# EAGLE design 1541_Multi-ROM_Rev1.1 (EAGLE 9.7.0)
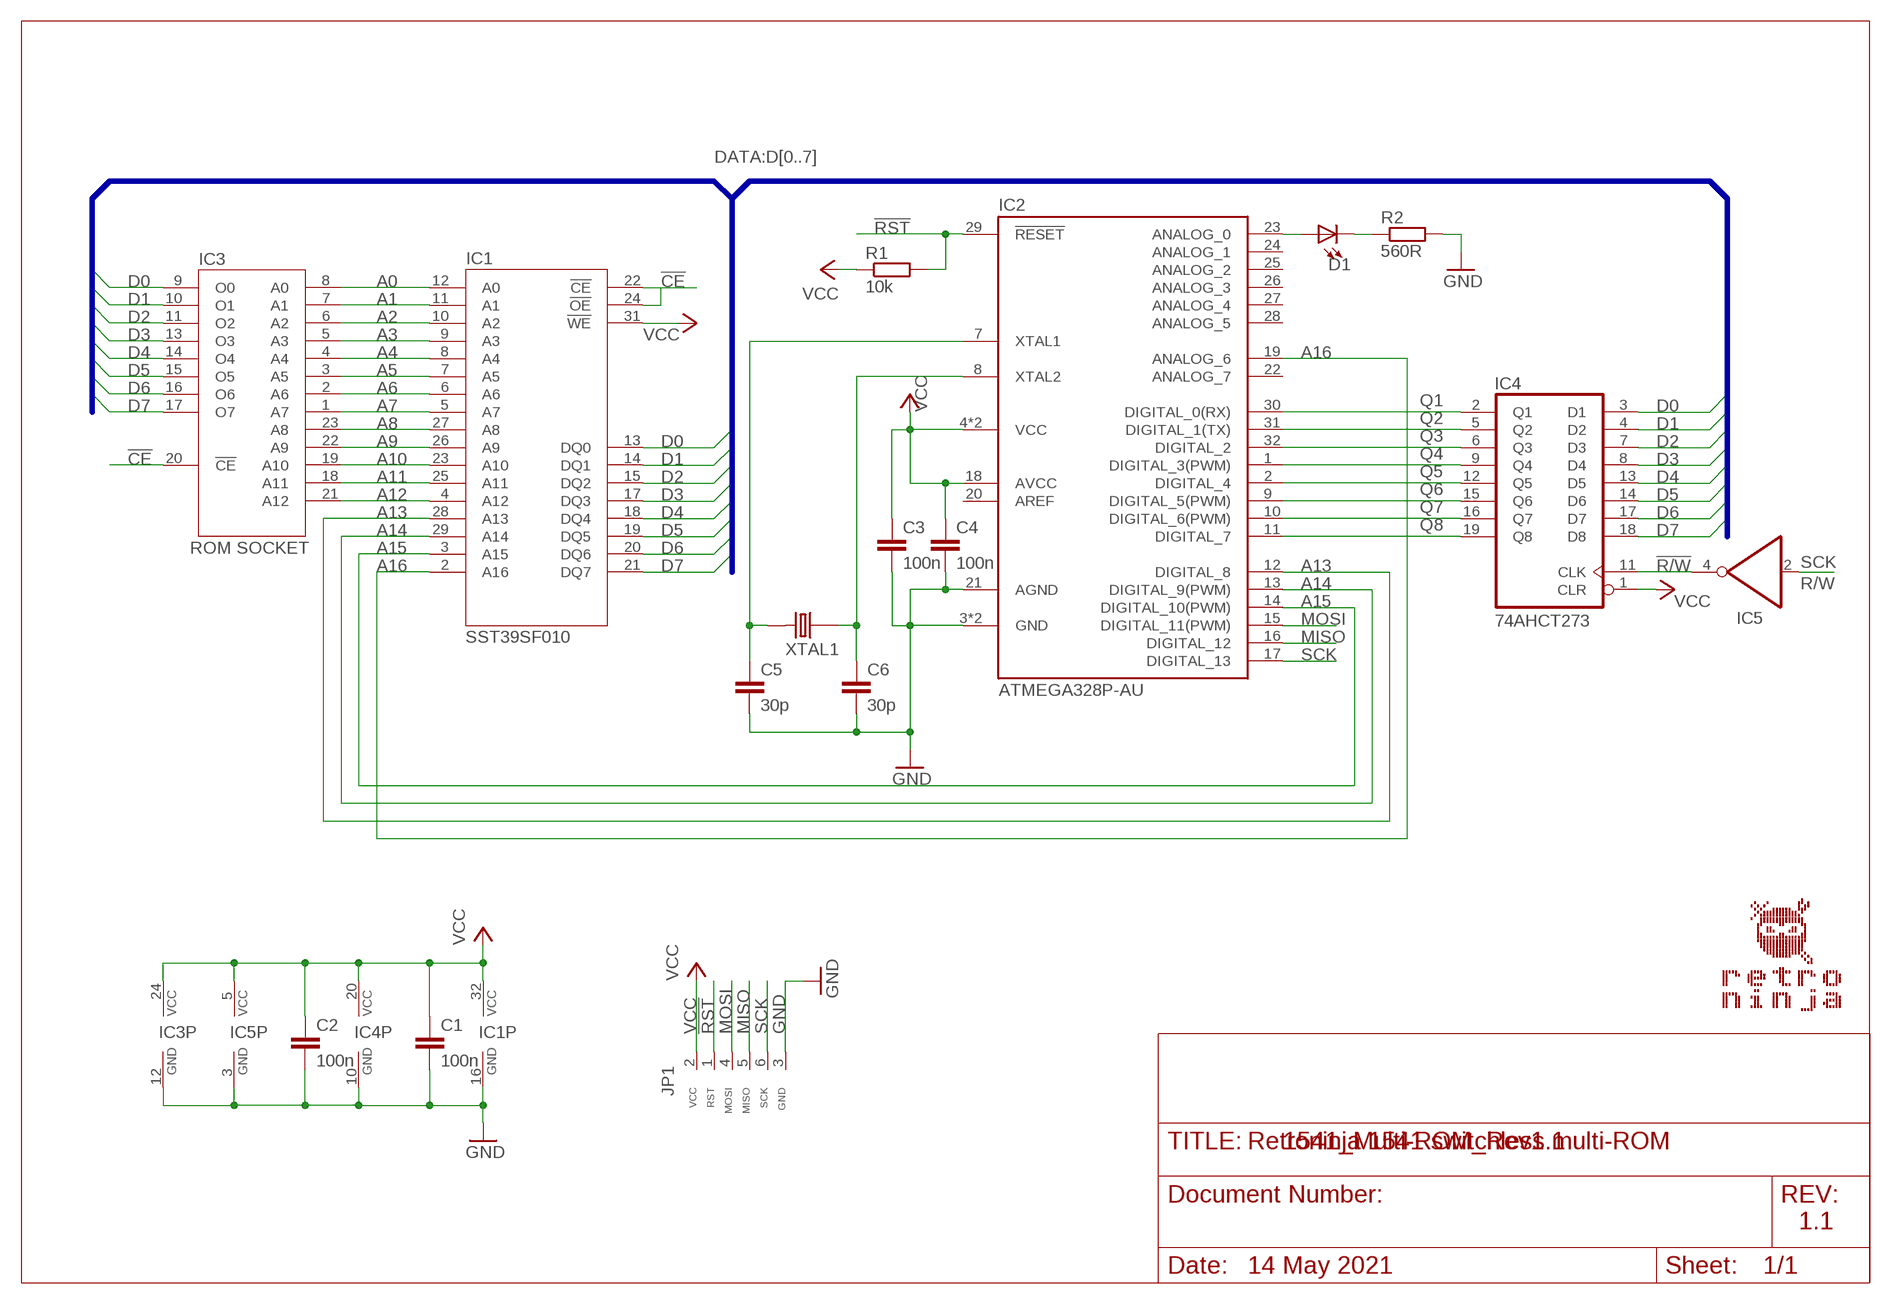
[diagram p0: schematic, sheet 1]

## Parts
C1  100n  C-EUC0805  [C0805]
C2  100n  C-EUC0805  [C0805]
C3  100n  C-EUC0805  [C0805]
C4  100n  C-EUC0805  [C0805]
C5  30p  C-EUC0805  [C0805]
C6  30p  C-EUC0805  [C0805]
D1  LED_0805  [LED0805]
IC1  SST39SF010  SST39XX010_PLCC_SHORT  [PLCC32_SHORT]
IC2  ATMEGA328P-AU  ARDUINO_168_328_TQFP  [TQFP32]
IC3  ROM SOCKET  2364_DOWNPINS  [DIL24-6_DOWNPINS]
IC4  74AHCT273  74273NS  [SO20]
IC5  741G04_SOT23  [SOT23-5]
JP1  ICSP_CONNECTOR_TL866_RIGHT2  [HEADER_1X6_RIGHT]
R1  10k  R-EU_R0805  [R0805]
R2  560R  R-EU_R0805  [R0805]
XTAL1  CRYSTAL  [CRYSTAL_SMD-2_7X4X2.3]

## Nets
!CE: IC1.22(!CE) IC3.20(!CE)
!R/W: IC4.11(CLK) IC5.4(O)
!RST: IC2.29(!RESET) JP1.1(RST) R1.2
A0: IC1.12(A0) IC3.8(A0)
A1: IC1.11(A1) IC3.7(A1)
A2: IC1.10(A2) IC3.6(A2)
A3: IC1.9(A3) IC3.5(A3)
A4: IC1.8(A4) IC3.4(A4)
A5: IC1.7(A5) IC3.3(A5)
A6: IC1.6(A6) IC3.2(A6)
A7: IC1.5(A7) IC3.1(A7)
A8: IC1.27(A8) IC3.23(A8)
A9: IC1.26(A9) IC3.22(A9)
A10: IC1.23(A10) IC3.19(A10)
A11: IC1.25(A11) IC3.18(A11)
A12: IC1.4(A12) IC3.21(A12)
A13: IC1.28(A13) IC2.12(DIGITAL_8)
A14: IC1.29(A14) IC2.13(DIGITAL_9(PWM))
A15: IC1.3(A15) IC2.14(DIGITAL_10(PWM))
A16: IC1.2(A16) IC2.19(ANALOG_6)
D0: IC1.13(DQ0) IC3.9(O0) IC4.3(D1)
D1: IC1.14(DQ1) IC3.10(O1) IC4.4(D2)
D2: IC1.15(DQ2) IC3.11(O2) IC4.7(D3)
D3: IC1.17(DQ3) IC3.13(O3) IC4.8(D4)
D4: IC1.18(DQ4) IC3.14(O4) IC4.13(D5)
D5: IC1.19(DQ5) IC3.15(O5) IC4.14(D6)
D6: IC1.20(DQ6) IC3.16(O6) IC4.17(D7)
D7: IC1.21(DQ7) IC3.17(O7) IC4.18(D8)
GND: C1.2 C2.2 C3.2 C4.2 C5.2 C6.2 IC1.16(GND) IC2.3(GND) IC2.5(GND) IC2.21(AGND) IC3.12(GND) IC4.10(GND) IC5.3(GND) JP1.3(GND) R2.2
MISO: IC2.16(DIGITAL_12) JP1.5(MISO)
MOSI: IC2.15(DIGITAL_11(PWM)) JP1.4(MOSI)
N$1: IC1.24(!OE)
N$16: C6.1 IC2.8(XTAL2) XTAL1.1
N$17: C5.1 IC2.7(XTAL1) XTAL1.2
N$25: D1.A IC2.23(ANALOG_0)
N$26: D1.C R2.1
Q1: IC2.30(DIGITAL_0(RX)) IC4.2(Q1)
Q2: IC2.31(DIGITAL_1(TX)) IC4.5(Q2)
Q3: IC2.32(DIGITAL_2) IC4.6(Q3)
Q4: IC2.1(DIGITAL_3(PWM)) IC4.9(Q4)
Q5: IC2.2(DIGITAL_4) IC4.12(Q5)
Q6: IC2.9(DIGITAL_5(PWM)) IC4.15(Q6)
Q7: IC2.10(DIGITAL_6(PWM)) IC4.16(Q7)
Q8: IC2.11(DIGITAL_7) IC4.19(Q8)
SCK: IC2.17(DIGITAL_13) IC5.2(I) JP1.6(SCK)
VCC: C1.1 C2.1 C3.1 C4.1 IC1.31(!WE) IC1.32(VCC) IC2.4(VCC) IC2.6(VCC) IC2.18(AVCC) IC3.24(VCC) IC4.1(CLR) IC4.20(VCC) IC5.5(VCC) JP1.2(VCC) R1.1
Unconnected: IC2.20(AREF) IC2.22(ANALOG_7) IC2.24(ANALOG_1) IC2.25(ANALOG_2) IC2.26(ANALOG_3) IC2.27(ANALOG_4) IC2.28(ANALOG_5)

## Buses
DATA:D[0..7]

## Notes on the sheet
- R/W
- Retroninja 1541 switchless multi-ROM
- 1.1
- 14 May 2021

## Library data of the parts
C1-C6 = rcl:C-EU: CAPACITOR, European symbol; SPICEPREFIX: C
D1 = Per (Fusion 360):LED
IC1 = Per (Fusion 360):SST39XX010
IC2 = Per (Fusion 360):ARDUINO_168_328
IC3 = Per (Fusion 360):2364
IC4 = Per (Fusion 360):74*273
IC5 = Per (Fusion 360):74*1G04
JP1 = Per (Fusion 360):ICSP_CONNECTOR: PIN HEADER
R1 R2 = rcl:R-EU_: RESISTOR, European symbol; SPICEPREFIX: R
XTAL1 = Per (Fusion 360):CRYSTAL

## Board
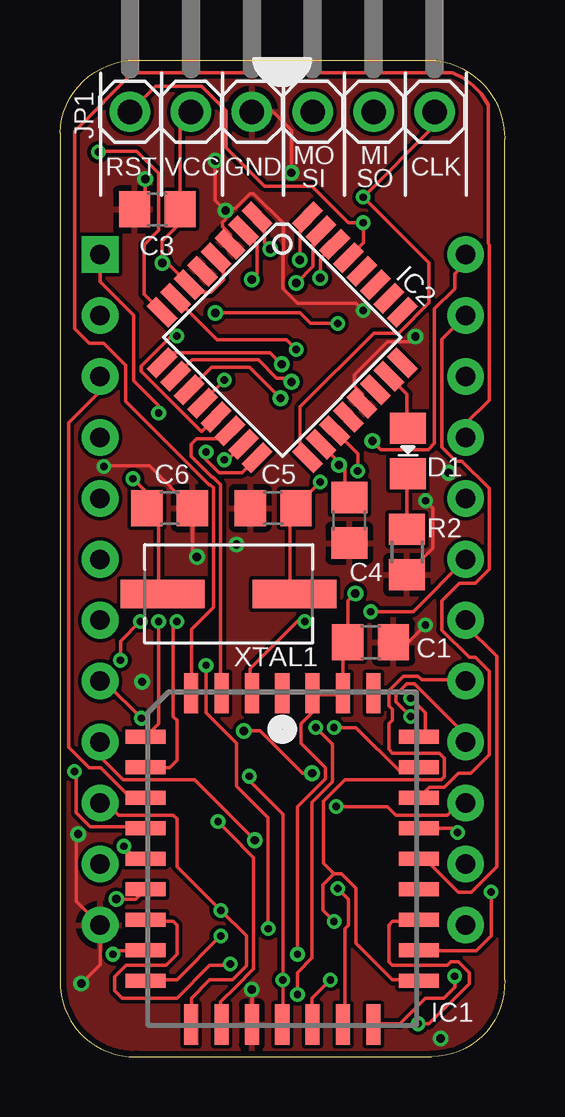
[diagram p1: board, top side]
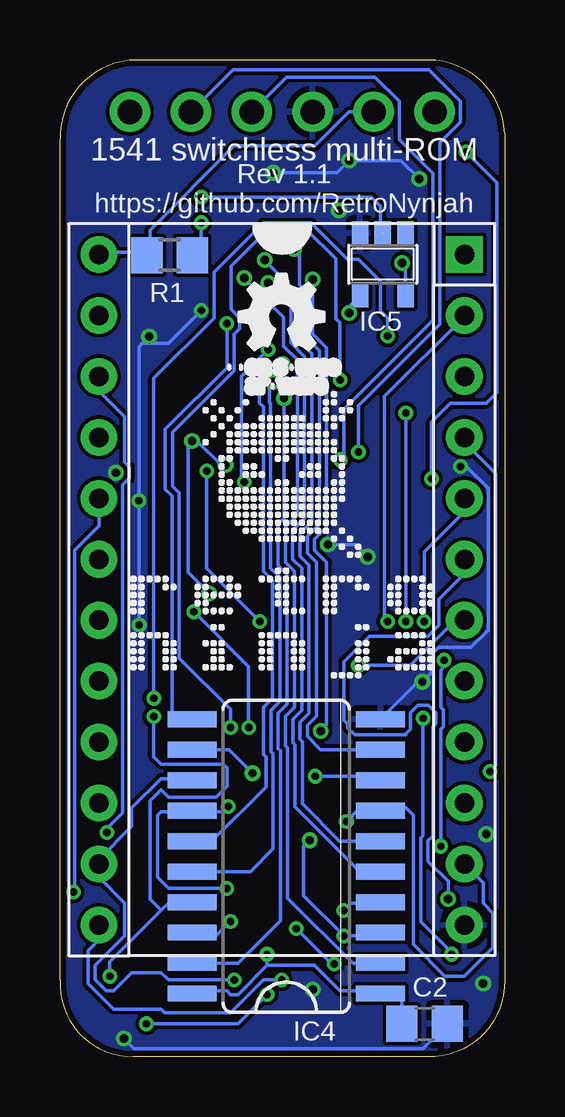
[diagram p2: board, bottom side, seen from below]

Size 18.54 x 41.53 mm. Coordinates in mm from the lower left corner, seen from the top.
Outline: 3.17,0 15.49,0 arc92 18.54,3.17 18.54,38.23 arc90 15.37,41.53 3.17,41.53 arc88 0,38.48 0,3.17 arc92 3.17,0
Copper layers (1*16): Top 0.035mm / dielectric 1.5mm / Bottom 0.035mm
Design rules "SeeedStudio_2layer_DRU_no_angle_20140221": minimum track width 6mil, minimum drill 12mil, track to track 6mil, track to pad 6mil, pad to pad 6mil, via to via 6mil, smd to smd 0mil, copper to edge 10mil, drill to drill 10mil, minimum pad ring 10mil, minimum via ring 6mil, stop-mask expansion 2mil, vias tented up to drill 100mil, thermal gap 10mil

### Footprints (pad centres in the part's own frame; a part is rotated, then mirrored left to right if it is on the bottom)
C0805 = smd 1.3 x 1.5: 1 -0.95,0; 2 0.95,0
LED0805 = smd 1.3 x 1.5: A -0.95,0; C 0.95,0
PLCC32_SHORT = smd 0.584 x 1.676: 1 0,6.9; 2 -1.27,6.9; 3 -2.54,6.9; 4 -3.81,6.9; 14 -3.81,-6.9; 15 -2.54,-6.9; 16 -1.27,-6.9; 17 0,-6.9; 18 1.27,-6.9; 19 2.54,-6.9; 20 3.81,-6.9; 30 3.81,6.9; 31 2.54,6.9; 32 1.27,6.9 | smd 1.676 x 0.584: 5 -5.7,5.08; 6 -5.7,3.81; 7 -5.7,2.54; 8 -5.7,1.27; 9 -5.7,0; 10 -5.7,-1.27; 11 -5.7,-2.54; 12 -5.7,-3.81; 13 -5.7,-5.08; 21 5.7,-5.08; 22 5.7,-3.81; 23 5.7,-2.54; 24 5.7,-1.27; 25 5.7,0; 26 5.7,1.27; 27 5.7,2.54; 28 5.7,3.81; 29 5.7,5.08
TQFP32 = smd 1.27 x 0.559: 1 -4.293,2.8; 2 -4.293,2; 3 -4.293,1.2; 4 -4.293,0.4; 5 -4.293,-0.4; 6 -4.293,-1.2; 7 -4.293,-2; 8 -4.293,-2.8; 17 4.293,-2.8; 18 4.293,-2; 19 4.293,-1.2; 20 4.293,-0.4; 21 4.293,0.4; 22 4.293,1.2; 23 4.293,2; 24 4.293,2.8 | smd 0.559 x 1.27: 9 -2.8,-4.293; 10 -2,-4.293; 11 -1.2,-4.293; 12 -0.4,-4.293; 13 0.4,-4.293; 14 1.2,-4.293; 15 2,-4.293; 16 2.8,-4.293; 25 2.8,4.293; 26 2,4.293; 27 1.2,4.293; 28 0.4,4.293; 29 -0.4,4.293; 30 -1.2,4.293; 31 -2,4.293; 32 -2.8,4.293
DIL24-6_DOWNPINS = drill 0.813 pad 1.524 square: 1 -15.24,-7.62 | drill 0.813 pad 1.524: 2 -12.7,-7.62; 3 -10.16,-7.62; 4 -7.62,-7.62; 5 -5.08,-7.62; 6 -2.54,-7.62; 7 0,-7.62; 8 2.54,-7.62; 9 5.08,-7.62; 10 7.62,-7.62; 11 10.16,-7.62; 12 12.7,-7.62; 13 12.7,7.62; 14 10.16,7.62; 15 7.62,7.62; 16 5.08,7.62; 17 2.54,7.62; 18 0,7.62; 19 -2.54,7.62; 20 -5.08,7.62; 21 -7.62,7.62; 22 -10.16,7.62; 23 -12.7,7.62; 24 -15.24,7.62
SO20 = smd 0.66 x 2.032: 1 -5.369,-4.019; 2 -4.099,-4.019; 3 -2.829,-4.019; 4 -1.559,-4.019; 5 -0.289,-4.019; 6 0.981,-4.019; 7 2.251,-4.019; 8 3.521,-4.019; 9 4.791,-4.019; 10 6.061,-4.019; 11 6.061,3.839; 12 4.791,3.839; 13 3.521,3.839; 14 2.251,3.839; 15 0.981,3.839; 16 -0.289,3.839; 17 -1.559,3.839; 18 -2.829,3.839; 19 -4.099,3.839; 20 -5.369,3.839
SOT23-5 = smd 0.69 x 0.99: 1 -0.95,-1.29; 2 0,-1.29; 3 0.95,-1.29; 4 0.95,1.3; 5 -0.95,1.3
HEADER_1X6_RIGHT = drill 1.016 pad 1.676: 1 -6.35,-1.27; 2 -3.81,-1.27; 3 -1.27,-1.27; 4 1.27,-1.27; 5 3.81,-1.27; 6 6.35,-1.27
R0805 = smd 1.3 x 1.5: 1 -0.95,0; 2 0.95,0
CRYSTAL_SMD-2_7X4X2.3 = smd 3.5 x 1.2: 1 -2.75,0; 2 2.75,0

### Placement (x,y rotation side)
C1  12.95,17.27 0 top
C2  3.34,1.36 0 bottom
C3  4.06,35.31 180 top
C4  12.06,22.35 270 top
C5  8.89,22.86 180 top
C6  4.57,22.86 0 top
D1  14.52,25.23 270 top
IC1  9.27,8.25 0 top
IC2  9.27,29.97 315 top
IC3  9.3,18.19 270 top
IC4  9.19,8 90 bottom
IC5  5.08,33.02 180 bottom
JP1  9.27,40.64 0 top
R1  13.97,33.4 0 bottom
R2  14.48,21.03 270 top
U$1  [RETRONINJA_12MM]  15.62,15.75 0 bottom
U$2  [OSHW_5MM]  11.68,27.69 0 bottom
XTAL1  7.04,19.28 0 top

### Tracks (layer width: path | path; a pad name or v marks a point on that pad's centre or on a via)
!CE  (via drill 0.3)
  Top 0.152: v17.98,6.86 17.98,5.03 17.37,4.42 15.09,4.42 IC1.22
  Bottom 0.152: v17.98,6.86 17.93,6.91 17.93,21.11 16.92,22.13 IC3.20
!R/W  (via drill 0.3, 0.35)
  Top 0.152: v11.58,30.56 10.44,30.56 10.01,30.99 v6.48,30.99
  Bottom 0.152: IC4.11 13.11,14.17 13.72,14.17 13.87,14.33 13.87,23.37 14.15,23.65 14.15,26.14 11.58,28.7 v11.58,30.56 | IC5.4 6.48,31.27 v6.48,30.99
!RST  (via drill 0.3)
  Top 0.152: JP1.1 3.99,40.44 5.9,40.44 6.93,39.41 6.93,37.87 8.53,36.27 10.51,36.27 12.04,34.75 v12.65,34.75 12.65,34.29 12.65,33.98 12.65,33.92 IC2.29
  Bottom 0.152: v12.65,34.75 12.65,33.83 12.95,33.53 R1.2
A0  (via drill 0.3)
  Top 0.152: IC1.12 3.5,4.42 2.36,4.42 v2.21,4.27 | IC3.8 1.68,15.54 1.95,15.54 v3.4,14.1
  Bottom 0.152: v2.21,4.27 2.21,4.34 3.5,5.63 3.5,9.11 3.4,9.21 v3.4,14.1
A1  (via drill 0.3)
  Top 0.152: v8.69,5.33 8.69,9.96 7.37,11.28 7.37,13.06 6.1,14.33 v6.1,16.31 | IC1.11 3.66,5.64 4.72,5.64 4.88,5.49 4.88,4.27 4.42,3.81 2.76,3.81 2.29,3.33 2.29,2.74 2.59,2.44 4.88,2.44 6.25,3.81 7.04,3.81 v7.1,3.87
  Bottom 0.152: IC3.7 1.68,18.14 2.1,18.14 3.93,16.31 v6.1,16.31 | v8.69,5.33 7.22,3.87 v7.1,3.87
A2  (via drill 0.35)
  Top 0.152: IC1.10 3.16,6.57 v2.35,6.57
  Bottom 0.152: IC3.6 1.68,20.12 2.74,19.05 2.74,17.98 3.2,17.53 5.64,17.53 6.71,16.46 6.71,14.02 6.55,13.87 6.55,13.72 6.25,13.41 4.12,13.41 4.12,13.45 3.93,13.64 3.93,14.32 3.62,14.63 3.18,14.63 2.86,14.32 2.86,13.88 3,13.75 3,9.18 3.19,8.99 3.19,8.14 2.35,7.3 v2.35,6.57
A3  (via drill 0.3)
  Top 0.152: IC1.9 3.18,8.25 v2.66,8.77 | v3.35,18.14 2.53,17.31 v2.53,16.52
  Bottom 0.152: v3.35,18.14 3.35,21.03 1.68,22.71 IC3.5 | v2.66,8.77 2.66,10.15 2.67,10.16 2.67,13.65 2.56,13.75 2.56,14.45 2.67,14.56 2.67,16.11 2.53,16.25 v2.53,16.52
A4  (via drill 0.3)
  Top 0.152: v0.61,11.89 0.69,11.81 0.69,10.16 1.27,9.58 3.51,9.58 IC1.8
  Bottom 0.152: v0.61,11.89 0.36,12.14 0.36,24.28 1.68,25.6 IC3.4
A5
  Top 0.152: IC3.3 1.68,27.74 0.36,26.42 0.36,12.9 1.22,12.04 1.7,12.04 2.92,10.82 3.5,10.82 IC1.7
A6  (via drill 0.3)
  Top 0.152: v4.88,18.14 4.72,17.98 4.72,14.17 4.88,14.02 4.88,12.34 4.57,12.04 3.66,12.04 IC1.6
  Bottom 0.152: v4.88,18.14 5,18.26 5,27.51 1.68,30.84 IC3.2
A7  (via drill 0.3)
  Top 0.152: v4.12,26.82 4.12,27.13 3.08,28.17 3.08,30.89 1.68,32.29 IC3.1 | v4.12,18.14 4.12,13.87 IC1.5
  Bottom 0.152: v4.12,18.14 v4.12,26.82
A8
  Top 0.152: IC1.27 15.41,11.23 16.03,11.23 16.61,11.81 17.14,11.81 17.91,12.57 17.91,16.06 17.33,16.64 17.07,16.64 15.93,17.78 15.93,19 16.66,19.74 17.33,19.74 17.91,20.32 17.91,23.68 16.77,24.82 16.51,24.82 15.93,25.4 15.93,29.9 IC3.23
A9  (via drill 0.3)
  Top 0.152: IC1.26 16.42,9.52 v16.59,9.35
  Bottom 0.152: IC3.22 16.92,27.74 15.85,26.67 15.85,24.76 15.65,24.56 15.65,24.1 15.93,23.82 15.93,10.16 16.59,9.5 v16.59,9.35
A10  (via drill 0.3)
  Top 0.152: v14.94,1.37 15.39,1.37 17.07,3.05 17.07,3.5 16.61,3.96 16.31,3.96 16.15,3.81 13.87,3.81 13.72,3.96 13.72,5.49 13.87,5.64 14.94,5.64 IC1.23 | v9.91,2.59 9.91,3.5 10.52,4.12 10.52,10.6 11.37,11.45 11.37,13.01 v10.67,13.72 | IC3.19 14.73,18.54 v12.95,18.54
  Bottom 0.152: v14.94,1.37 11.12,1.37 v9.91,2.59 | v10.67,13.72 10.67,16.26 v12.95,18.54
A11
  Top 0.152: IC3.18 16.92,17.98 18.21,16.69 18.21,7.92 17.15,6.86 16.61,6.86 15.24,8.23 15.09,8.23 IC1.25
A12
  Top 0.152: IC3.21 16.92,26.36 17.91,27.36 17.91,33.84 17.86,33.89 17.86,39.68 17.85,39.7 17.57,40.12 17.22,40.48 16.81,40.78 16.37,41 3.04,41 0.61,38.57 0.61,30.33 1.22,29.72 1.83,29.72 2.74,28.8 2.74,27.31 6.21,23.84 6.27,23.84 6.4,23.7 6.4,18.72 5.49,17.81 5.49,15.24 IC1.4
A13  (via drill 0.3)
  Top 0.152: v11.43,13.72 12.34,13.72 14.17,11.89 14.78,11.89 14.94,12.04 IC1.28 | IC2.12 5.95,27.29 v6.86,28.19
  Bottom 0.152: v11.43,13.72 11.43,14.48 13.56,16.61 13.56,23.49 13.84,23.77 13.84,26.01 11.28,28.58 11.28,30.11 11.05,30.34 11.05,30.78 11.41,31.14 11.41,32.93 9.91,34.44 8.23,34.44 7.03,33.25 7.03,30.76 6.86,30.58 v6.86,28.19
A14  (via drill 0.3)
  Top 0.152: v14.63,14.94 15.24,14.33 15.24,13.41 15.09,13.26 IC1.29 | IC2.13 5.92,26.06 5.89,26.06 3.38,28.57 3.38,28.76 4.64,30.02 v4.88,30.02
  Bottom 0.152: v4.88,30.02 4.88,30.79 5.18,31.09 5.18,32.31 6.1,33.22 6.55,33.22 8.08,34.75 10.06,34.75 12.12,32.69 12.12,30.78 14.63,28.26 v14.63,14.94
A15
  Top 0.152: IC1.3 6.71,15.24 6.71,23.83 6.39,24.14 6.34,24.14 5.46,25.02 5.46,25.53 5.69,25.76 6.75,25.76 IC2.14
A16  (via drill 0.3)
  Top 0.152: v10.21,18.14 9.91,18.14 7.92,16.15 7.92,15.24 IC1.2 | v12.42,24.41 v12.43,24.42 12.43,25.12 IC2.19
  Bottom 0.152: v10.21,18.14 12.43,20.35 v12.43,24.4 v12.42,24.41
D0  (via drill 0.3, 0.35)
  Top 0.152: v6.71,5.03 4.88,3.2 3.66,3.2 IC1.13 | v8.13,9.02 5.61,11.54 2.64,11.54 1.68,12.5 IC3.9
  Bottom 0.152: IC4.3 5.18,5.03 v6.71,5.03 8.38,6.71 8.38,8.76 v8.13,9.02
D1  (via drill 0.3)
  Top 0.152: IC1.14 5.49,1.37 5.49,2.44 6.25,3.2 7.19,3.2 7.77,3.78 7.77,5.03 v6.71,6.1 4.88,7.92 4.88,9.91 4.72,10.06 2.44,10.06 1.98,10.52 1.68,10.52 IC3.10
  Bottom 0.152: v6.71,6.1 6.4,6.4 5.18,6.4 IC4.4
D2  (via drill 0.3)
  Top 0.152: IC1.15 6.71,1.37 6.71,2.29 7.32,2.9 8.08,3.66 8.08,8.28 7.57,8.79 7.57,8.82 v6.59,9.8
  Bottom 0.152: IC3.11 0.89,7.24 0.89,6.39 0.48,5.98 0.48,4.55 1.68,3.35 2.48,3.35 3.81,4.68 3.81,10.06 4.12,10.36 5.03,10.36 IC4.7 5.18,10.36 6.03,10.36 v6.59,9.8
D3  (via drill 0.3)
  Top 0.152: IC1.17 9.3,1.37 v9.3,3.2 9.3,10.11 7.9,11.51 v7.9,11.68
  Bottom 0.152: IC4.8 5.34,11.68 v7.9,11.68 | IC3.13 16.92,4.88 17.37,4.42 17.37,3.05 16.31,1.98 14.33,1.98 14.17,1.83 11.43,1.83 10.06,3.2 v9.3,3.2
D4  (via drill 0.3)
  Top 0.152: v11.28,3.2 10.52,2.44 10.52,1.37 IC1.18
  Bottom 0.152: v11.28,3.2 14.02,3.2 14.33,3.5 15.54,3.5 16.31,2.74 16.61,2.74 17.07,3.2 17.07,3.81 15.85,5.03 15.85,6.4 16.92,7.47 IC3.14 16.92,8.23 15.54,9.6 15.54,10.36 14.33,11.58 13.11,11.58 IC4.13
D5  (via drill 0.3)
  Top 0.152: v11.58,7.01 12.04,6.55 12.04,5.49 11.89,5.33 11.89,1.37 IC1.19 | IC3.15 16.92,10.52 16.61,10.52 16.15,10.06 14.02,10.06 13.66,10.42 v11.53,10.42
  Bottom 0.152: v11.58,7.01 14.02,7.01 14.48,7.47 14.48,10.06 14.33,10.21 13.11,10.21 IC4.14 12.95,10.21 11.73,10.21 v11.53,10.42
D6  (via drill 0.3)
  Top 0.152: v16.46,3.35 16.46,2.9 16,2.44 15.24,2.44 14.17,1.37 13.11,1.37 IC1.20 | IC3.16 16.92,13.41 14.78,15.54 14.48,15.54 14.02,15.09 14.02,14.78 v14.63,14.17
  Bottom 0.152: v16.46,3.35 16.46,3.96 14.33,6.1 | 14.33,6.1 14.02,6.4 13.11,6.4 IC4.17 | v14.63,14.17 14.63,12.5 14.33,12.19 11.73,12.19 11.58,12.04 11.58,11.28 12.04,10.82 14.02,10.82 14.33,11.12 14.78,10.67 14.78,6.55 14.33,6.1
D7  (via drill 0.3)
  Top 0.152: 11.43,7.62 11.73,7.62 12.34,7.01 12.34,4.72 13.87,3.2 14.94,3.2 IC1.21 | 11.43,7.62 10.97,7.16 10.97,6.1 v11.43,5.64 | IC3.17 16.92,15.7 15.09,15.7 14.94,15.85 14.33,15.85 13.72,15.24 13.72,14.63 13.87,14.48 13.87,14.02 13.72,13.87 13.72,12.8 13.87,12.65 15.83,12.65 16.04,12.44 16.04,11.67 15.9,11.54 11.89,11.54 10.99,10.64 10.99,8.06 11.43,7.62
  Bottom 0.152: v11.43,5.64 12.04,5.03 12.95,5.03 IC4.18
GND  (via drill 0.3, 0.35)
  Top 0.152: v15.24,17.98 14.17,16.92 13.87,16.92 C1.2 | R2.2 14.48,20.12 15.54,21.18 15.54,22.86 v15.25,23.15 v15.25,23.16 | v0.89,3.05 1.68,3.83 IC3.12 0.69,6.48 0.69,9.2 v0.76,9.27 | IC1.16 v8,2.79 | IC2.3 7.08,34.27 6.78,34.58 6.78,34.77 6.91,34.9 v6.91,35.26 | v5.71,20.83 5.52,21.02 C6.2 5.49,22.86 3.73,24.61 1.85,24.61 v1.83,24.59 | IC2.21 12.59,27.63 12.28,27.94 12.28,28.41 13.66,29.79 14.6,29.79 v14.82,30.01 | v12.65,31.09 12.34,31.39 9.91,31.39 9.3,32 9.3,33.4 9.32,33.42 9.32,34.72 8.08,35.97 7.92,35.97 7.32,35.36 7.01,35.36 v6.91,35.26 | C3.2 3.56,35.75 v3.56,36.58 | v6.91,35.26 6.48,35.69 v6.48,37.34 | v9.65,36.83 9.65,38.61 8.89,39.37 JP1.3
  Bottom 0.152: v15.24,23.16 v15.24,17.98 | IC4.10 3.62,15.62 v3.43,15.62 3.06,15.99 3.06,16.74 2.75,17.05 1.41,17.05 0.69,17.78 0.69,23.68 1.6,24.59 v1.83,24.59 | v5.71,20.83 6.22,21.34 v7.37,21.34 | v15.25,23.16 v15.24,23.16 | 15.11,29.72 15.24,29.59 v15.24,23.16 | v12.65,31.09 14.02,29.72 15.11,29.72 | v3.56,36.58 4.32,37.34 v6.48,37.34 6.99,36.83 v9.65,36.83 | v15.88,0.76 15.45,0.34 3.41,0.34 C2.2 | 15.11,29.72 v14.82,30.01
  other vias: 16.2,24.33
  pour Top: 0.08,0.08 18.47,0.08 18.47,41.58 0.08,41.58
  pour Bottom: 0.08,0.08 18.47,0.08 18.47,41.58 0.08,41.58
MISO  (via drill 0.3)
  Top 0.152: v6.1,25.2 5.97,25.07 5.97,25 6.63,24.34 7.6,24.34 IC2.16
  Bottom 0.152: v6.1,25.2 6.1,27.13 2.69,30.53 2.69,38.09 1.85,38.93 1.85,39.81 3.17,41.12 11.33,41.12 JP1.5
MOSI  (via drill 0.3)
  Top 0.152: IC2.15 7,24.87 v6.85,24.87
  Bottom 0.152: v6.85,24.87 6.71,25.02 6.71,26.98 3,30.68 3,36.81 4.39,38.2 4.39,39.81 5.4,40.82 9.09,40.82 JP1.4
N$16  (via drill 0.3)
  Top 0.152: v1.6,37.69 1.63,37.72 3.2,37.72 4.12,36.8 4.12,34.44 3.5,33.83 3.5,31.78 IC2.8 | v3.05,24.08 3.66,23.47 3.66,22.86 C6.1 3.81,22.86 4.12,22.55 4.12,19.39 XTAL1.1
  Bottom 0.152: v3.05,24.08 3.05,26.44 2.26,27.23 0.76,27.23 0.33,27.66 0.33,36.42 v1.6,37.69
N$17  (via drill 0.3)
  Top 0.152: 9.75,22.86 9.6,22.71 9.6,19.41 XTAL1.2 | 9.75,22.86 C5.1 | v9.86,29.46 9.45,29.87 6.54,29.87 IC2.7 | 9.75,22.86 10.84,23.94 v10.86,23.94
  Bottom 0.152: v9.86,29.46 10.97,28.35 10.97,24.06 v10.86,23.94
N$25
  Top 0.152: D1.A 14.48,26.21 14.48,27.59 IC2.23
N$26
  Top 0.152: R2.1 14.48,24.23 D1.C
Q1  (via drill 0.35)
  Top 0.152: IC2.30 10.86,33.26 v10.86,32.45
  Bottom 0.152: v10.86,32.45 9.22,30.81 9.22,29.61 8.64,29.03 8.64,22.57 9.14,22.07 9.14,20.6 8.76,20.22 8.76,14.56 9.14,14.18 9.14,12.96 9.04,12.87 9.04,6.61 6.33,3.9 IC4.2
Q2  (via drill 0.35)
  Top 0.152: v9.86,32.23 | v9.86,32.23 10.55,32.93 10.55,34.08 IC2.31
  Bottom 0.152: v9.86,32.23 8.91,31.29 8.91,29.74 8.34,29.16 8.34,22.44 8.84,21.95 8.84,20.73 8.46,20.35 8.46,14.43 8.83,14.06 8.83,13.09 8.74,12.99 8.74,10.41 6.04,7.71 IC4.5
Q3  (via drill 0.35)
  Top 0.152: v10,33.2 10.02,33.22 10.02,34.68 IC2.32
  Bottom 0.152: v10,33.2 10,33.16 8.61,31.77 8.61,29.86 8.03,29.29 8.03,22.32 8.53,21.82 8.53,20.85 8.15,20.48 8.15,14.31 8.53,13.93 8.53,13.22 8.43,13.12 8.43,10.54 6.88,8.98 IC4.6
Q4  (via drill 0.35)
  Top 0.152: v8.77,33.66 8.53,33.9 8.53,34.68 IC2.1
  Bottom 0.152: IC4.9 7.67,12.79 8.22,13.34 8.22,13.8 7.85,14.18 7.85,20.6 8.23,20.98 8.23,21.69 7.73,22.19 7.73,29.41 8.31,29.99 8.31,31.9 8.56,32.16 8.56,33.44 v8.77,33.66
Q5  (via drill 0.35)
  Top 0.152: v7.67,13.57 8.34,13.57 10.11,11.81 v10.51,11.81 | v8,32.38 8.21,32.6 8.21,33.86 IC2.2
  Bottom 0.152: v8,32.38 8,30.12 7.42,29.54 7.42,22.07 7.92,21.57 7.92,21.11 7.42,20.6 7.42,13.82 v7.67,13.57 | IC4.12 11.49,12.79 v10.51,11.81
Q6  (via drill 0.35)
  Top 0.152: v9.25,28.85 8.76,29.34 4.68,29.34 IC2.9
  Bottom 0.152: v9.25,28.85 9.27,28.83 9.73,28.83 10.21,28.35 10.21,27.23 10.06,27.07 10.06,20.22 9.68,19.84 9.68,14.94 10.05,14.56 10.05,12.59 9.96,12.49 9.96,11.23 12.21,8.98 IC4.15
Q7  (via drill 0.35)
  Top 0.152: v9.65,28.12 9.5,28.27 9.04,28.27 8.28,29.03 5.5,29.03 IC2.10
  Bottom 0.152: IC4.16 10.6,7.71 9.65,8.66 9.65,12.62 9.75,12.71 9.75,14.44 9.37,14.81 9.37,19.97 9.75,20.35 9.75,27.2 9.79,27.24 9.79,27.98 v9.65,28.12
Q8  (via drill 0.35)
  Top 0.152: 6.33,28.73 6.35,28.73 7.9,28.73 v9.2,27.43 | IC2.11 6.33,28.73 | 6.33,28.73
  Bottom 0.152: IC4.19 11.11,3.9 9.35,5.67 9.35,12.74 9.44,12.84 9.44,14.31 9.07,14.69 9.07,20.1 9.45,20.47 9.45,22.2 9.2,22.45 v9.2,27.43
SCK  (via drill 0.3)
  Top 0.152: JP1.6 15.62,38.79 v12.65,35.81 15.39,33.07 15.39,31.41 14.13,30.15 13.08,30.15 10.02,27.09 10.02,25.27 IC2.17
  Bottom 0.152: IC5.2 5.18,34.44 5.18,35.43 5.56,35.81 v12.65,35.81
VCC  (via drill 0.3, 0.35)
  Top 0.152: IC3.24 16.92,33.07 16.46,32.61 16.46,32 15.62,31.17 15.62,25.56 15.36,25.3 13.39,25.3 v13.03,25.65 | v9.91,4.27 9.91,10.42 11.07,11.58 11.07,12.04 10.06,13.05 10.06,13.87 10.52,14.33 10.52,15.09 IC1.32 10.67,15.09 11.73,15.09 IC1.31 11.81,17.08 C1.1 12,18.99 v12.32,19.3 | C4.1 11.89,23.48 11.89,24.59 11.82,24.66 v11.64,24.66 11.64,24.78 IC2.18 | JP1.2 5.01,38.92 C3.1 4.88,35.2 4.88,34.59 4.27,33.98 v4.27,33.07 4.47,33.07 IC2.6 5.7,31.85 6.3,31.85 6.83,32.38 6.83,32.98 IC2.4
  Bottom 0.152: IC3.24 16.92,33.38 16.31,33.38 16.15,33.53 14.94,33.53 R1.1 14.78,33.53 14.78,34.44 11.28,37.95 7.92,37.95 6.49,39.37 JP1.2 | 9.91,3.81 11.12,2.59 11.43,2.59 11.58,2.74 12.95,2.74 IC4.20 | 9.91,3.81 7.92,3.81 6.86,2.74 5.18,2.74 IC4.1 5.03,2.74 4.29,2.74 C2.1 | 9.91,3.81 v9.91,4.27 | v11.64,24.66 11.82,24.66 12.82,25.65 v13.03,25.65 13.21,25.48 13.21,20.19 v12.32,19.3 | IC5.5 4.13,32.93 v4.27,33.07

### Text on the board
tPlace: RST | VCC | GND | MO / SI | MI / SO | CLK
bPlace: 1541 switchless multi-ROM | Rev 1.1 | https://github.com/RetroNynjah